# EAGLE design Input_v1_1 (EAGLE 9.6.2)
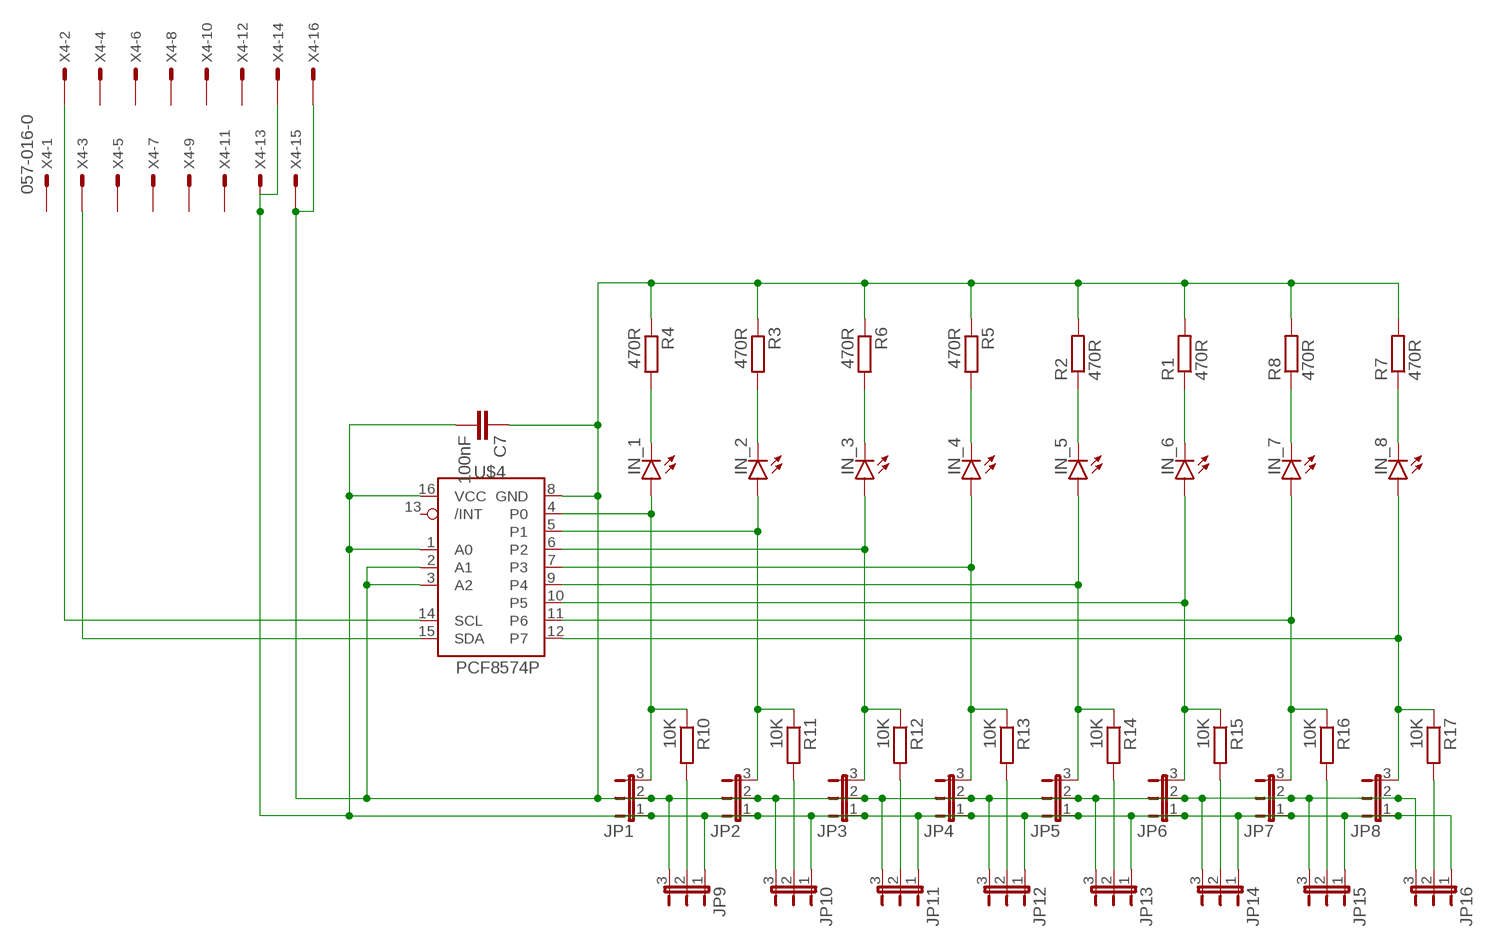
[diagram p0: schematic, sheet 1]

## Parts
C7  100nF  C-EU025-024X044  [C025-024X044]
IN_1  LED3MM  [LED3MM]
IN_2  LED3MM  [LED3MM]
IN_3  LED3MM  [LED3MM]
IN_4  LED3MM  [LED3MM]
IN_5  LED3MM  [LED3MM]
IN_6  LED3MM  [LED3MM]
IN_7  LED3MM  [LED3MM]
IN_8  LED3MM  [LED3MM]
JP1  JP2E  [JP2]
JP2  JP2E  [JP2]
JP3  JP2E  [JP2]
JP4  JP2E  [JP2]
JP5  JP2E  [JP2]
JP6  JP2E  [JP2]
JP7  JP2E  [JP2]
JP8  JP2E  [JP2]
JP9  JP2E  [JP2]
JP10  JP2E  [JP2]
JP11  JP2E  [JP2]
JP12  JP2E  [JP2]
JP13  JP2E  [JP2]
JP14  JP2E  [JP2]
JP15  JP2E  [JP2]
JP16  JP2E  [JP2]
R1  470R  R-EU_0309/10  [0309/10]
R2  470R  R-EU_0309/10  [0309/10]
R3  470R  R-EU_0309/10  [0309/10]
R4  470R  R-EU_0309/10  [0309/10]
R5  470R  R-EU_0309/10  [0309/10]
R6  470R  R-EU_0309/10  [0309/10]
R7  470R  R-EU_0309/10  [0309/10]
R8  470R  R-EU_0309/10  [0309/10]
R10  10K  R-EU_0309/10  [0309/10]
R11  10K  R-EU_0309/10  [0309/10]
R12  10K  R-EU_0309/10  [0309/10]
R13  10K  R-EU_0309/10  [0309/10]
R14  10K  R-EU_0309/10  [0309/10]
R15  10K  R-EU_0309/10  [0309/10]
R16  10K  R-EU_0309/10  [0309/10]
R17  10K  R-EU_0309/10  [0309/10]
U$4  PCF8574P  [DIL16]
X4  057-016-0  [057-016-0]

## Nets
GND1: C7.1 JP1.2 JP2.2 JP3.2 JP4.2 JP5.2 JP6.2 JP7.2 JP8.2 JP9.3 JP10.3 JP11.3 JP12.3 JP13.3 JP14.3 JP15.3 JP16.3 R1.2 R2.2 R3.1 R4.1 R5.1 R6.1 R7.2 R8.2 U$4.2(A1) U$4.3(A2) U$4.8(GND) X4.15 X4.16
N$1: IN_8.K(C) R7.1
N$2: IN_7.K(C) R8.1
N$3: IN_6.K(C) R1.1
N$4: IN_5.K(C) R2.1
N$5: IN_4.K(C) R5.2
N$6: IN_3.K(C) R6.2
N$7: IN_2.K(C) R3.2
N$8: IN_1.K(C) R4.2
N$9: U$4.15(SDA) X4.3
N$10: JP9.2 R10.2
N$11: JP10.2 R11.2
N$12: JP11.2 R12.2
N$13: JP12.2 R13.2
N$14: JP13.2 R14.2
N$15: JP14.2 R15.2
N$16: JP15.2 R16.2
N$17: JP16.2 R17.2
N$21: IN_1.A JP1.3 R10.1 U$4.4(P0)
N$22: IN_2.A JP2.3 R11.1 U$4.5(P1)
N$23: IN_3.A JP3.3 R12.1 U$4.6(P2)
N$24: IN_4.A JP4.3 R13.1 U$4.7(P3)
N$25: IN_5.A JP5.3 R14.1 U$4.9(P4)
N$26: IN_6.A JP6.3 R15.1 U$4.10(P5)
N$27: IN_7.A JP7.3 R16.1 U$4.11(P6)
N$28: IN_8.A JP8.3 R17.1 U$4.12(P7)
SCL: U$4.14(SCL) X4.2
VCC5.0: C7.2 JP1.1 JP2.1 JP3.1 JP4.1 JP5.1 JP6.1 JP7.1 JP8.1 JP9.1 JP10.1 JP11.1 JP12.1 JP13.1 JP14.1 JP15.1 JP16.1 U$4.1(A0) U$4.16(VCC) X4.13 X4.14
Unconnected: U$4.13(/INT) X4.1 X4.4 X4.5 X4.6 X4.7 X4.8 X4.9 X4.10 X4.11 X4.12

## Library data of the parts
C7 = resistor:C-EU: CAPACITOR, European symbol
IN_1-IN_8 = led:LED: LED OSRAM: - CHIPLED LG R971, LG N971, LY N971, LG Q971, LY Q971, LO R971, LY R971 LH N974, LH R974 LS Q976, LO Q976, LY Q976 LO Q996 - Hyper CHIPLED LW Q18S LB Q993, LB Q99A, LB R99A - SideLED LS A670, LO A670, LY A670, LG A670, LP A670 LB A673, LV A673, LT A673, LW A673 LH A674 LY A675 LS A676, LA A676, LO A676, LY A676, LW A676 LS A679, LY A679, LG A679 - Hyper Micro SIDELED® LS Y876, LA Y876, LO Y876, LY Y876 LT Y87S - SmartLED LW L88C, LW L88S LB L89C, LB L89S, LG L890 LS L89K, LO L89K, LY L89K LS L896, LA L896, LO L896, LY L896 - TOPLED LS T670, LO T670, LY T670, LG T670, LP T670 LSG T670, LSP T670, LSY T670, LOP T670, LYG T670 LG T671, LOG T671, LSG T671 LB T673, LV T673, LT T673, LW T673 LH T674 LS T676, LA T676, LO T676, LY T676, LB T676, LH T676, LSB T676, LW T676 LB T67C, LV T67C, LT T67C, LS T67K, LO T67K, LY T67K, LW E67C LS E67B, LA E67B, LO E67B, LY E67B, LB E67C, LV E67C, LT E67C LW T67C LS T679, LY T679, LG T679 LS T770, LO T770, LY T770, LG T770, LP T770 LB T773, LV T773, LT T773, LW T773 LH T774 LS E675, LA E675, LY E675, LS T675 LS T776, LA T776, LO T776, LY T776, LB T776 LHGB T686 LT T68C, LB T68C - Hyper Mini TOPLED® LB M676 - Mini TOPLED Santana® LG M470 LS M47K, LO M47K, LY M47K Source: http://www.osram.convergy.de LUXEON: - LUMILED® LXK2-PW12-R00, LXK2-PW12-S00, LXK2-PW14-U00, LXK2-PW14-V00 LXK2-PM12-R00, LXK2-PM12-S00, LXK2-PM14-U00 LXK2-PE12-Q00, LXK2-PE12-R00, LXK2-PE12-S00, LXK2-PE14-T00, LXK2-PE14-U00 LXK2-PB12-K00, LXK2-PB12-L00, LXK2-PB12-M00, LXK2-PB14-N00, LXK2-PB14-P00, LXK2-PB14-Q00 LXK2-PR12-L00, LXK2-PR12-M00, LXK2-PR14-Q00, LXK2-PR14-R00 LXK2-PD12-Q00, LXK2-PD12-R00, LXK2-PD12-S00 LXK2-PH12-R00, LXK2-PH12-S00 LXK2-PL12-P00, LXK2-PL12-Q00, LXK2-PL12-R00 Source: www.luxeon.com KINGBRIGHT: KA-3528ASYC Source: www.kingbright.com
JP1-JP16 = jumper:JP2E: JUMPER
R1-R8 R10-R17 = resistor:R-EU_: RESISTOR, European symbol
U$4 = i2c:PCF8574: Remote 8-Bit I/O Expander for I²C Bus
X4 = con-panduit:057-016-: CONNECTOR 10-pin series 057 contact pc board low profile headers; OC_FARNELL: unknown; OC_NEWARK: unknown

## Board
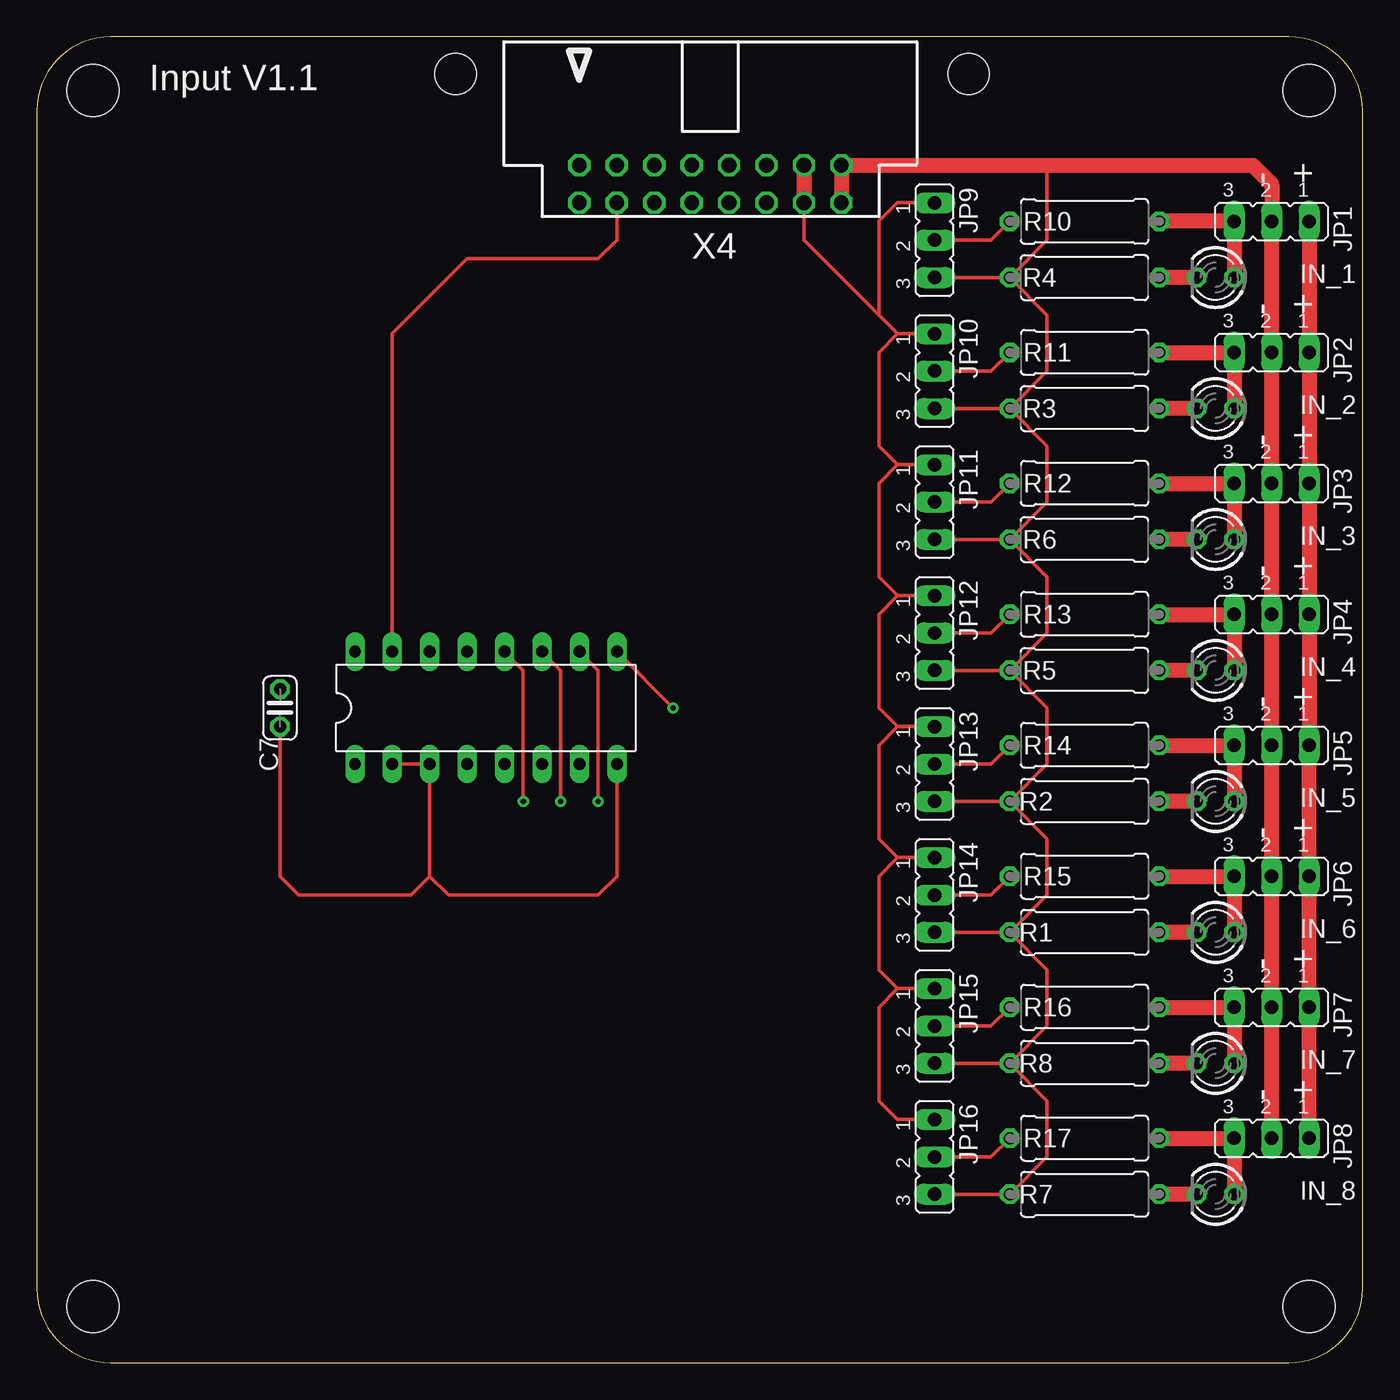
[diagram p1: board, top side]
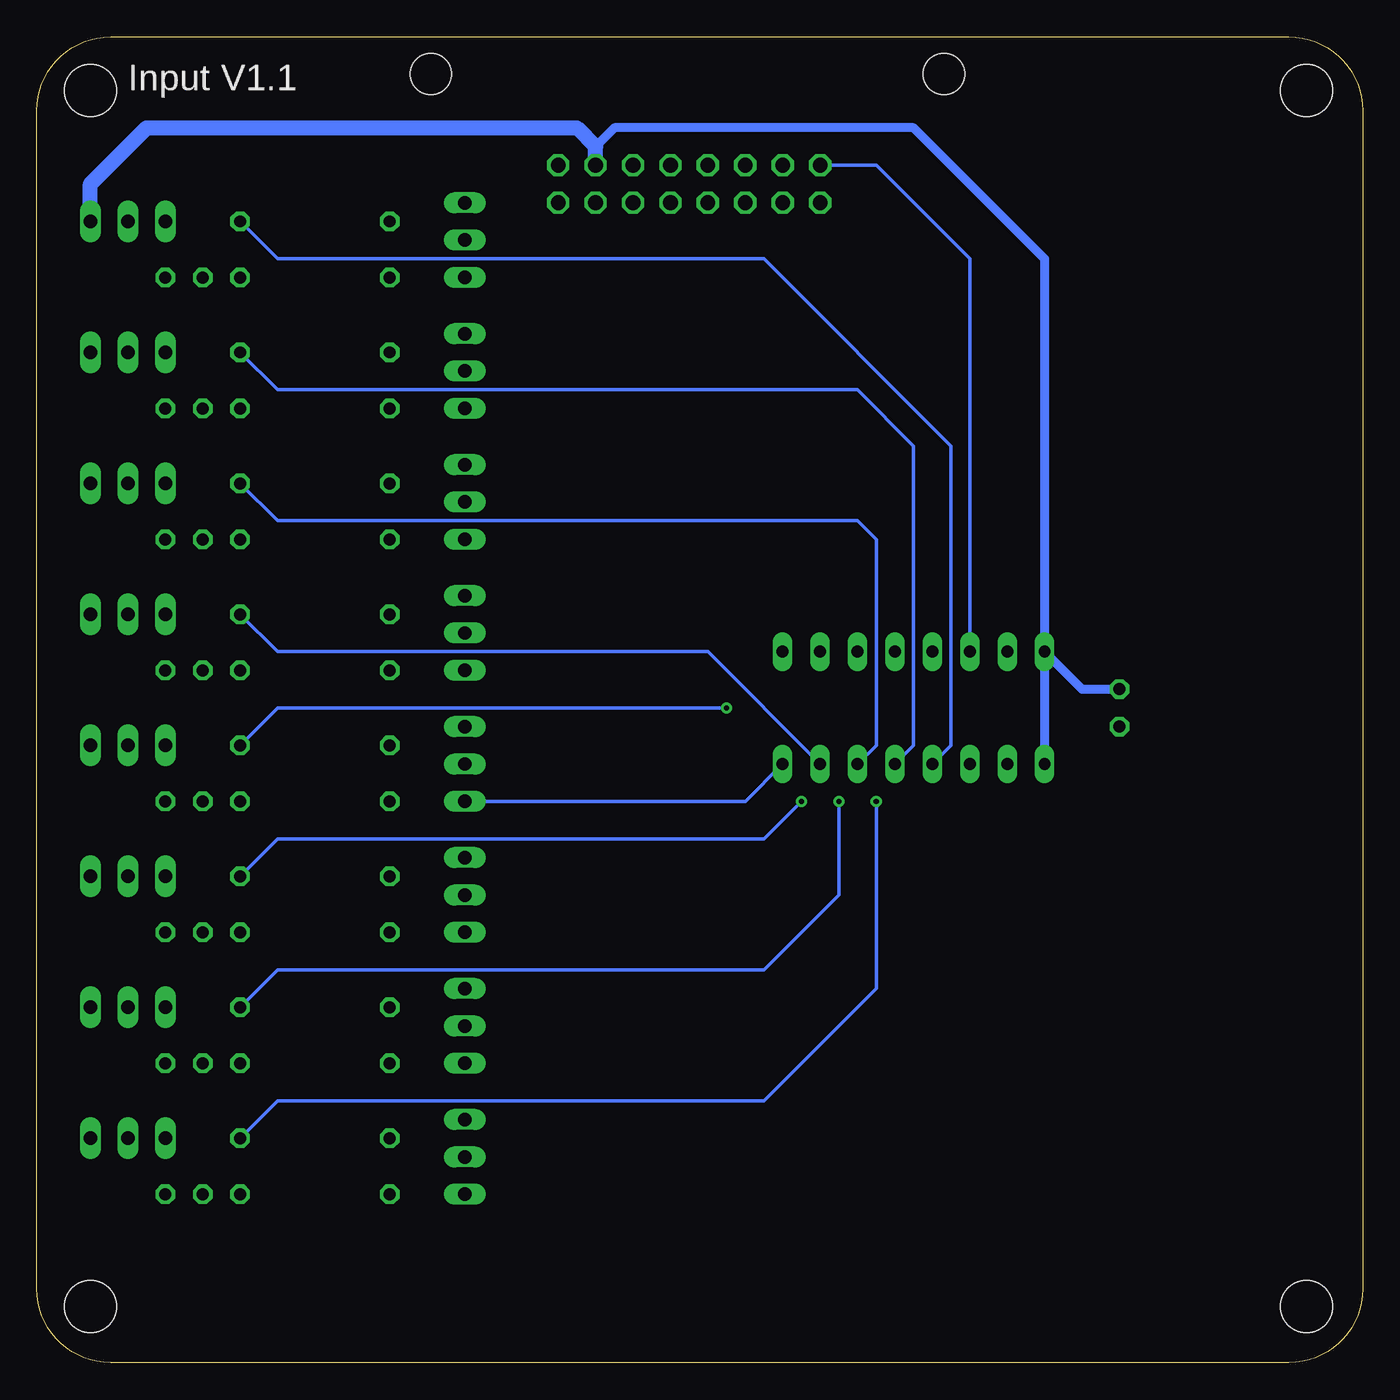
[diagram p2: board, bottom side, seen from below]

Size 90 x 90 mm. Coordinates in mm from the lower left corner, seen from the top.
Outline: 0,85 0,5 arc90 5,0 85,0 arc90 90,5 90,85 arc90 85,90 5,90 arc90 0,85
Copper layers (1*16): Top 0.035mm / dielectric 1.5mm / Bottom 0.035mm
Design rules "default": minimum track width 6mil, minimum drill 0.35mm, track to track 6mil, track to pad 6mil, pad to pad 6mil, via to via 6mil, smd to smd 6mil, copper to edge 40mil, drill to drill 6mil, minimum pad ring 10mil, minimum via ring 8mil, stop-mask expansion 4mil, vias tented up to drill 0mil, thermal gap 10mil
Holes 3.5 mm at 86.36,86.36 3.81,86.36 3.81,3.81 86.36,3.81

### Footprints (pad centres in the part's own frame; a part is rotated, then mirrored left to right if it is on the bottom)
C025-024X044 = drill 0.813 octagon: 1 -1.27,0; 2 1.27,0
LED3MM = drill 0.813 octagon: A -1.27,0; K 1.27,0
JP2 = drill 0.914 long: 1 -2.54,0; 2 0,0; 3 2.54,0
0309/10 = drill 0.813 octagon: 1 -5.08,0; 2 5.08,0
DIL16 = drill 0.813 long: 1 -8.89,-3.81; 2 -6.35,-3.81; 3 -3.81,-3.81; 4 -1.27,-3.81; 5 1.27,-3.81; 6 3.81,-3.81; 7 6.35,-3.81; 8 8.89,-3.81; 9 8.89,3.81; 10 6.35,3.81; 11 3.81,3.81; 12 1.27,3.81; 13 -1.27,3.81; 14 -3.81,3.81; 15 -6.35,3.81; 16 -8.89,3.81
057-016-0 = drill 1 octagon: 1 -8.89,-5.08; 2 -8.89,-2.54; 3 -6.35,-5.08; 4 -6.35,-2.54; 5 -3.81,-5.08; 6 -3.81,-2.54; 7 -1.27,-5.08; 8 -1.27,-2.54; 9 1.27,-5.08; 10 1.27,-2.54; 11 3.81,-5.08; 12 3.81,-2.54; 13 6.35,-5.08; 14 6.35,-2.54; 15 8.89,-5.08; 16 8.89,-2.54 | hole 2.8: -17.29,3.66; 17.54,3.66

### Placement (x,y rotation side)
C7  16.51,44.45 90 top
IN_1  80.01,73.66 180 top
IN_2  80.01,64.77 180 top
IN_3  80.01,55.88 180 top
IN_4  80.01,46.99 180 top
IN_5  80.01,38.1 180 top
IN_6  80.01,29.21 180 top
IN_7  80.01,20.32 180 top
IN_8  80.01,11.43 180 top
JP1  83.82,77.47 180 top
JP2  83.82,68.58 180 top
JP3  83.82,59.69 180 top
JP4  83.82,50.8 180 top
JP5  83.82,41.91 180 top
JP6  83.82,33.02 180 top
JP7  83.82,24.13 180 top
JP8  83.82,15.24 180 top
JP9  60.96,76.2 270 top
JP10  60.96,67.31 270 top
JP11  60.96,58.42 270 top
JP12  60.96,49.53 270 top
JP13  60.96,40.64 270 top
JP14  60.96,31.75 270 top
JP15  60.96,22.86 270 top
JP16  60.96,13.97 270 top
R1  71.12,29.21 180 top
R2  71.12,38.1 180 top
R3  71.12,64.77 0 top
R4  71.12,73.66 0 top
R5  71.12,46.99 0 top
R6  71.12,55.88 0 top
R7  71.12,11.43 180 top
R8  71.12,20.32 180 top
R10  71.12,77.47 180 top
R11  71.12,68.58 180 top
R12  71.12,59.69 180 top
R13  71.12,50.8 180 top
R14  71.12,41.91 180 top
R15  71.12,33.02 180 top
R16  71.12,24.13 180 top
R17  71.12,15.24 180 top
U$4  30.48,44.45 0 top
X4  45.72,83.82 0 top

### Tracks (layer width: path | path; a pad name or v marks a point on that pad's centre or on a via)
GND1
  Top 0.254: JP9.3 R4.1 | JP11.3 R6.1 | JP12.3 R5.1 | JP13.3 R2.2 | JP15.3 R8.2 | JP14.3 R1.2 | JP16.3 R7.2 68.58,13.97 68.58,17.78 R8.2 | R8.2 68.58,22.86 68.58,26.67 R1.2 | R1.2 68.58,31.75 68.58,35.56 R2.2 | R2.2 68.58,40.64 68.58,44.45 R5.1 | R5.1 68.58,49.53 68.58,53.34 R6.1 | R6.1 68.58,58.42 68.58,62.23 R3.1 | R3.1 68.58,67.31 68.58,71.12 R4.1 | R4.1 68.58,76.2 68.58,81.28 | U$4.8 39.37,33.02 38.1,31.75 27.94,31.75 26.67,33.02 | 26.67,33.02 U$4.3 U$4.2 | 26.67,33.02 25.4,31.75 17.78,31.75 16.51,33.02 C7.1 | JP10.3 R3.1
  Top 1.016: X4.15 X4.16 68.58,81.28 82.55,81.28 83.82,80.01 JP1.2 JP2.2 JP3.2 JP4.2 JP5.2 JP6.2 JP7.2 JP8.2
  Bottom 0.254: U$4.8 41.91,38.1 JP13.3
N$1
  Top 1.016: IN_8.K R7.1
N$2
  Top 1.016: IN_7.K R8.1
N$3
  Top 1.016: IN_6.K R1.1
N$4
  Top 1.016: IN_5.K R2.1
N$5
  Top 1.016: IN_4.K R5.2
N$6
  Top 1.016: IN_3.K R6.2
N$7
  Top 1.016: IN_2.K R3.2
N$8
  Top 1.016: IN_1.K R4.2
N$9
  Top 0.254: U$4.15 24.13,69.85 29.21,74.93 38.1,74.93 39.37,76.2 X4.3
N$10
  Top 0.254: JP9.2 64.77,76.2 R10.2
N$11
  Top 0.254: JP10.2 64.77,67.31 R11.2
N$12
  Top 0.254: R12.2 64.77,58.42 JP11.2
N$13
  Top 0.254: JP12.2 64.77,49.53 R13.2
N$14
  Top 0.254: R14.2 64.77,40.64 JP13.2
N$15
  Top 0.254: JP14.2 64.77,31.75 R15.2
N$16
  Top 0.254: R16.2 64.77,22.86 JP15.2
N$17
  Top 0.254: R17.2 64.77,13.97 JP16.2
N$21
  Top 1.016: IN_1.A JP1.3 R10.1
  Bottom 0.254: U$4.4 27.94,41.91 27.94,62.23 40.64,74.93 73.66,74.93 R10.1
N$22
  Top 1.016: R11.1 JP2.3 IN_2.A
  Bottom 0.254: U$4.5 30.48,41.91 30.48,62.23 34.29,66.04 73.66,66.04 R11.1
N$23
  Top 1.016: R12.1 JP3.3 IN_3.A
  Bottom 0.254: U$4.6 33.02,41.91 33.02,55.88 34.29,57.15 73.66,57.15 R12.1
N$24
  Top 1.016: R13.1 JP4.3 IN_4.A
  Bottom 0.254: U$4.7 44.45,48.26 73.66,48.26 R13.1
N$25  (via drill 0.35)
  Top 0.254: U$4.9 v43.18,44.45
  Top 1.016: R14.1 JP5.3 IN_5.A
  Bottom 0.254: v43.18,44.45 73.66,44.45 R14.1
N$26  (via drill 0.35)
  Top 0.254: U$4.10 38.1,46.99 v38.1,38.1
  Top 1.016: R15.1 JP6.3 IN_6.A
  Bottom 0.254: R15.1 73.66,35.56 40.64,35.56 v38.1,38.1
N$27  (via drill 0.35)
  Top 0.254: U$4.11 35.56,46.99 v35.56,38.1
  Top 1.016: R16.1 JP7.3 IN_7.A
  Bottom 0.254: v35.56,38.1 35.56,31.75 40.64,26.67 73.66,26.67 R16.1
N$28  (via drill 0.35)
  Top 0.254: U$4.12 33.02,46.99 v33.02,38.1
  Top 1.016: R17.1 JP8.3 IN_8.A
  Bottom 0.254: v33.02,38.1 33.02,25.4 40.64,17.78 73.66,17.78 R17.1
SCL
  Bottom 0.254: U$4.14 26.67,74.93 33.02,81.28 X4.2
VCC5.0
  Top 0.254: JP16.1 58.42,16.51 57.15,17.78 57.15,24.13 58.42,25.4 | JP15.1 58.42,25.4 | 58.42,25.4 57.15,26.67 57.15,33.02 58.42,34.29 | JP14.1 58.42,34.29 | 58.42,34.29 57.15,35.56 57.15,41.91 58.42,43.18 | JP13.1 58.42,43.18 | 58.42,43.18 57.15,44.45 57.15,50.8 58.42,52.07 | JP12.1 58.42,52.07 | 58.42,52.07 57.15,53.34 57.15,59.69 58.42,60.96 | JP11.1 58.42,60.96 | 58.42,60.96 57.15,62.23 57.15,68.58 58.42,69.85 | JP10.1 58.42,69.85 | 58.42,69.85 57.15,71.12 | 57.15,71.12 57.15,77.47 58.42,78.74 JP9.1 | 57.15,71.12 52.07,76.2 X4.13
  Top 1.016: X4.14 X4.13 | JP1.1 JP2.1 JP3.1 JP4.1 JP5.1 JP6.1 JP7.1 JP8.1
  Bottom 0.61: 52.07,82.55 50.8,83.82 30.48,83.82 21.59,74.93 U$4.16 | U$4.16 19.05,45.72 C7.2 | U$4.16 U$4.1
  Bottom 1.016: JP1.1 86.36,80.01 82.55,83.82 53.34,83.82 52.07,82.55 X4.14

### Text on the board
tNames: Input V1.1 | - | + | - | + | - | + | - | + | - | + | - | + | - | + | - | +
bNames: Input V1.1